# Altium schematic sheet SCH_1.SchDoc
size A3; DrawnBy: Prateek; Engineer: Prateek; SheetNumber: 1; SheetTotal: 1
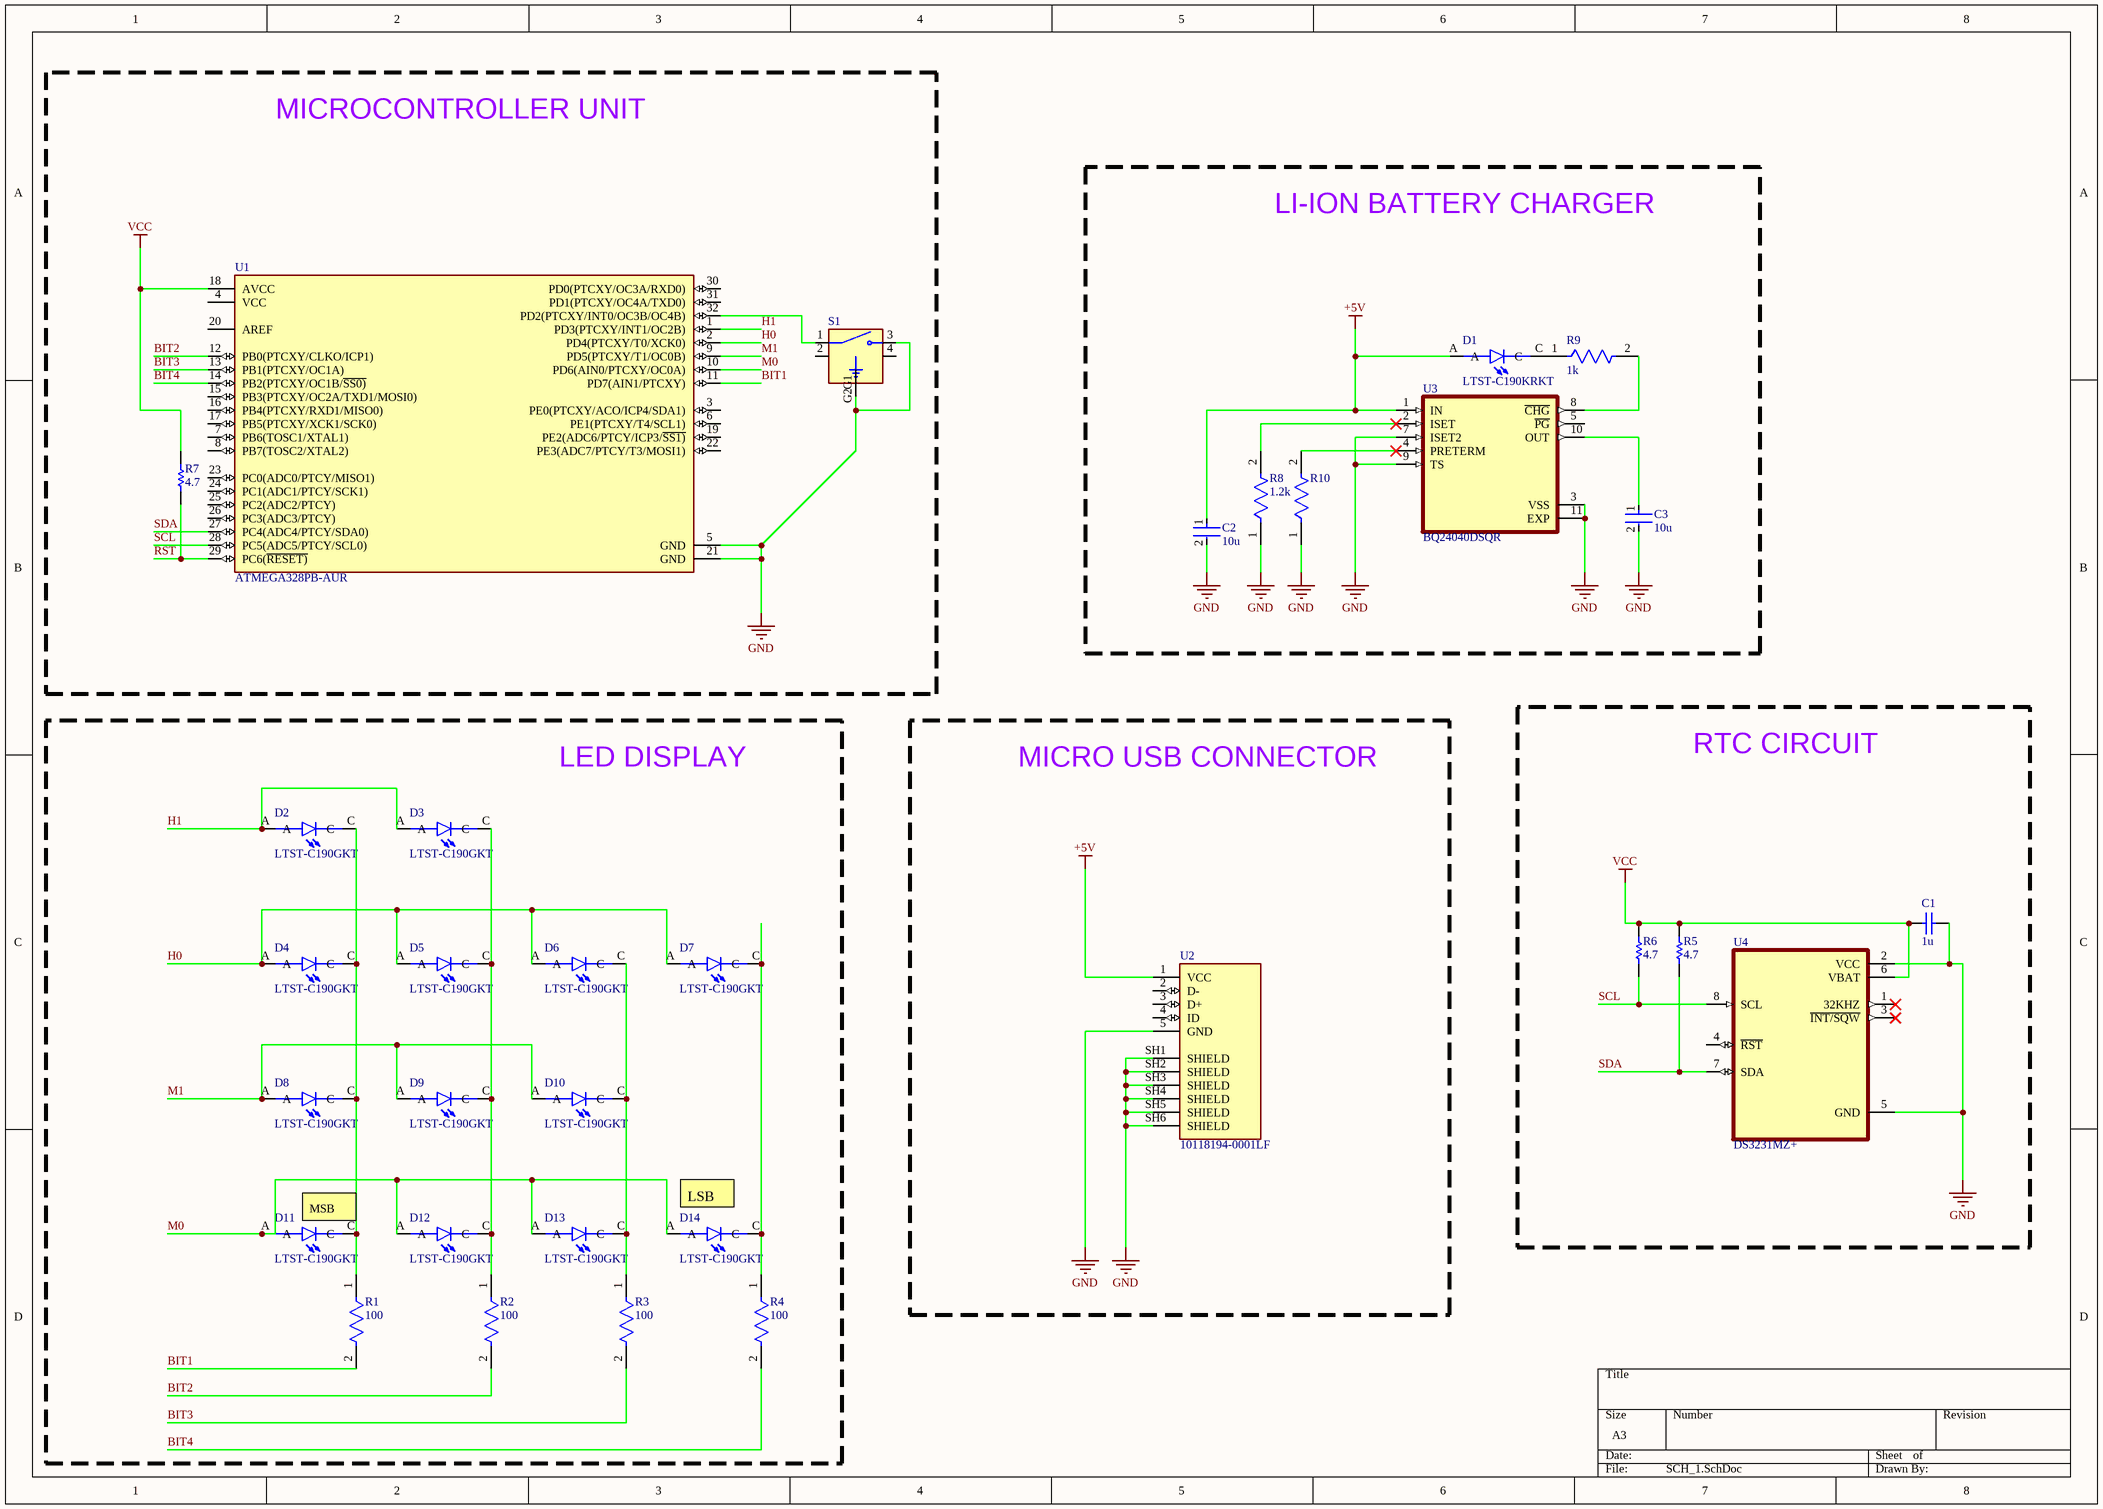
[diagram p0: SCH_1.SchDoc]

## Parts
C1  1u  [CAPC2013X135X45LL10T25]
C2  10u  [FP-GCM21B-0_15-IPC_C]
C3  10u  [FP-GCM21B-0_15-IPC_C]
D1  LTST-C190KRKT  [LEDC1608X35N]
D2  LTST-C190GKT  [LEDM1608X80]
D3  LTST-C190GKT  [LEDM1608X80]
D4  LTST-C190GKT  [LEDM1608X80]
D5  LTST-C190GKT  [LEDM1608X80]
D6  LTST-C190GKT  [LEDM1608X80]
D7  LTST-C190GKT  [LEDM1608X80]
D8  LTST-C190GKT  [LEDM1608X80]
D9  LTST-C190GKT  [LEDM1608X80]
D10  LTST-C190GKT  [LEDM1608X80]
D11  LTST-C190GKT  [LEDM1608X80]
D12  LTST-C190GKT  [LEDM1608X80]
D13  LTST-C190GKT  [LEDM1608X80]
D14  LTST-C190GKT  [LEDM1608X80]
R1  100  [FP-CRCW1206-e3-MFG]
R2  100  [FP-CRCW1206-e3-MFG]
R3  100  [FP-CRCW1206-e3-MFG]
R4  100  [FP-CRCW1206-e3-MFG]
R5  4.7  [RESC2013X70X40LL20T20]
R6  4.7  [RESC2013X70X40LL20T20]
R7  4.7  [RESC2013X70X40LL20T20]
R8  1.2k  [FP-CRCW1206-e3-MFG]
R9  1k  [FP-CRCW2512-e3-IPC_C]
R10  (no value)  [FP-CRCW0805-e3-IPC_C]
S1  (no value)  [SW_PTS526_SMG15_SMTR2_LFS]
U1  ATMEGA328PB-AUR  [FP-C04-074-MFG]
U2  10118194-0001LF  [AMPHENOL_10118194-0001LF]
U3  BQ24040DSQR  [SON40P200X200X80-11N]
U4  DS3231MZ+  [SOIC127P600X175-8N]

## Blocks framed on the sheet
MICROCONTROLLER UNIT: R7 S1 U1
LI-ION BATTERY CHARGER: C2 C3 D1 R8-R10 U3
RTC CIRCUIT: C1 R5 R6 U4
LED DISPLAY: D2-D14 R1-R4

## Nets
+5V: C2.1 D1.A U2.1(VCC) U3.1(IN)
GND: C1.2 C2.2 C3.2 R8.1 R10.1 S1.3(NO) S1.G2(GND) U1.5(GND) U1.21(GND) U2.5(GND) U2.SH1(SHIELD) U2.SH2(SHIELD) U2.SH3(SHIELD) U2.SH4(SHIELD) U2.SH5(SHIELD) U2.SH6(SHIELD) U3.3(VSS) U3.7(ISET2) U3.9(TS) U3.11(EXP) U4.2(VCC) U4.5(GND)
VCC: C1.1 R5.2 R6.2 R7.2 U1.18(AVCC) U4.6(VBAT)
BIT1: R1.2 U1.11(PD7(AIN1/PTCXY))
BIT2: R2.2 U1.12(PB0(PTCXY/CLKO/ICP1))
BIT3: R3.2 U1.13(PB1(PTCXY/OC1A))
BIT4: R4.2 U1.14(PB2(PTCXY/OC1B/~{SS0)})
H0: D4.A D5.A D6.A D7.A U1.2(PD4(PTCXY/T0/XCK0))
H1: D2.A D3.A U1.1(PD3(PTCXY/INT1/OC2B))
M0: D11.A D12.A D13.A D14.A U1.10(PD6(AIN0/PTCXY/OC0A))
M1: D8.A D9.A D10.A U1.9(PD5(PTCXY/T1/OC0B))
RST: R7.1 U1.29(PC6(~{RESET)})
SCL: R6.1 U1.28(PC5(ADC5/PTCY/SCL0)) U4.8(SCL)
SDA: R5.1 U1.27(PC4(ADC4/PTCY/SDA0)) U4.7(SDA)
NetC3_1: C3.1 U3.10(OUT)
NetD1_C: D1.C R9.1
NetD2_C: D2.C D4.C D8.C D11.C R1.1
NetD3_C: D3.C D5.C D9.C D12.C R2.1
NetD6_C: D6.C D10.C D13.C R3.1
NetD7_C: D7.C D14.C R4.1
NetR8_2: R8.2 U3.2(ISET)
NetR9_2: R9.2 U3.8(~{CHG})
NetR10_2: R10.2 U3.4(PRETERM)
NetS1_1: S1.1(COM) U1.32(PD2(PTCXY/INT0/OC3B/OC4B))

Not connected (* = marked no-connect by the designer): S1 2(COM) 4(NO) G1(GND); U1 3(PE0(PTCXY/ACO/ICP4/SDA1)) 4(VCC) 6(PE1(PTCXY/T4/SCL1)) 7(PB6(TOSC1/XTAL1)) 8(PB7(TOSC2/XTAL2)) 15(PB3(PTCXY/OC2A/TXD1/MOSI0)) 16(PB4(PTCXY/RXD1/MISO0)) 17(PB5(PTCXY/XCK1/SCK0)) 19(PE2(ADC6/PTCY/ICP3/~{SS1)}) 20(AREF) 22(PE3(ADC7/PTCY/T3/MOSI1)) 23(PC0(ADC0/PTCY/MISO1)) 24(PC1(ADC1/PTCY/SCK1)) 25(PC2(ADC2/PTCY)) 26(PC3(ADC3/PTCY)) 30(PD0(PTCXY/OC3A/RXD0)) 31(PD1(PTCXY/OC4A/TXD0)); U2 2(D-) 3(D+) 4(ID); U3 5(~{PG}); U4 1(32KHZ)* 3(~{INT/SQW})* 4(~{RST})

## Notes on the sheet
- MICRO USB CONNECTOR
- (near D11) MSB
- (near D14) LSB

## Library data of the parts
C1 = CMP-2007-03460-1: Manufacturer: Murata; Part Number: GRM21BR71C105KA01K
C2 C3 = CMP-2007-03335-2: Ceramic Capacitor for Automotive 10uF ±10% 6.3VDC X7R 0805 Embossed T/R; Voltage Rating: 6.3V; Voltage: 6.3V; Length: 2mm; Packaging: Tape and Reel; Radiation Hardening: No; Termination: SMD/SMT; Tolerance: 10%; Width: 0.049inch; Max Operating Temperature: 125°C; Mount: Surface Mount; Case/Package: 0805; Case Code (Imperial): 0805; Capacitance: 10uF; Ratings: AEC-Q200; Voltage Rating (DC): 6.3V; Height: 1.25mm; Dielectric: X7R; Case Code (Metric): 2012; Package Quantity: 1; Thickness: 0.055inch; Lead Free: Lead Free; Depth: 1.25mm; Min Operating Temperature: -55°C; REACH SVHC: No SVHC
D1 = LTST-C190KRKT: Red 631nm LED Indication - Discrete 2V 0603 (1608 Metric); MF: Lite-On Inc.; Check_prices: https://www.snapeda.com/parts/LTST-C190KRKT/Lite-On+Inc./view-part/?ref=eda; Value: *; Purchase-URL: https://pricing.snapeda.com/search/part/LTST-C190KRKT/?ref=eda; Price: None; MP: LTST-C190KRKT; SnapEDA_Link: https://www.snapeda.com/parts/LTST-C190KRKT/Lite-On+Inc./view-part/?ref=snap; Availability: In Stock; Package: 0603 Lite-On
D2-D14 = LTST-C190GKT: Green 1.6 x 0.8 x 0.8 mm 130Â° Water Clear 6 mcd 2.1 V SMT LED; Value: *; Price: None; Package: None; MP: LTST-C190GKT; Availability: Unavailable
R1-R4 = CMP-2003-04801-2: RES Thick Film, 100Ω, 1%, 0.25W, 100ppm/°C, 1206; Voltage Rating (DC): 200V; Resistance: 100R; Power Rating: 250mW; Case Code (Metric): 3216; Radiation Hardening: No; Height: 0.55mm; Packaging: Tape and Reel; Depth: 1.6mm; Weight: 0.000353oz; Termination: SMD/SMT; Lead Free: Lead Free; Min Operating Temperature: -55°C; Contact Plating: Tin; Max Operating Temperature: 155°C; Case Code (Imperial): 1206; Military Standard: Not; Width: 1.6mm; Number of Pins: 2; Voltage Rating: 200V; Composition: Thick Film; Package Quantity: 5000; Tolerance: 1%; Case/Package: 1206; Mount: Surface Mount; Length: 3.2mm; Temperature Coefficient: 100ppm/°C
R5-R7 = CMP-1665-00033-1: Chip Resistor, 4.7 Ohm, +/- 1%, 125 mW, -55 to 125 degC, 0805 (2012 Metric), RoHS, Tape and Reel; PartNumber: ERJ-6RQF4R7V; Power Rating: 125 mW; Case\/Package: 0805; Resistance: 4.7 Ohm; Mount: Surface Mount; Length: 0.079 inch; Tolerance: 1%; REACH SVHC: No SVHC; PackageDescription: 2-Pin Surface Mount Device, Body 2 x 1.5 mm; ComponentLink1URL: http://www.panasonic.com/; Width: 0.049 inch; Min Operating Temperature: -55 degC; Height: 0.028 inch; Case Code (Metric): 2012; Mounting Technology: Surface Mount; Pins: 2; Max Operating Temperature: 125 degC; Packaging: Tape and Reel; ComponentLink2URL: http://industrial.panasonic.com/cdbs/www-data/pdf/RDA0000/AOA0000C86.pdf; RoHSCompliant: true; ComponentLink2Description: Datasheet; PackageReference: 0805; Package Quantity: 5000; ComponentLink1Description: Manufacturer URL; Radiation Hardening: No; Case Code (Imperial): 0805; DatasheetVersion: 04/2015
R8 = CMP-2003-01876-2: RES Thick Film, 1.2kΩ, 1%, 0.25W, 100ppm/°C, 1206; Voltage Rating (DC): 200V; Power Rating: 250mW; Resistance: 1.2kR; Temperature Coefficient: 100ppm/°C; Features: Automotive AEC-Q200; Lead Free: Lead Free; Termination: SMD/SMT; Composition: Thick Film; Length: 3.2mm; Width: 0.063inch; Case Code (Imperial): 1206; Contact Plating: Tin; Number of Terminations: 2; Height: 0.55mm; Depth: 1.6mm; Max Operating Temperature: 155°C; Tolerance: 1%; Case/Package: 1206; Voltage Rating: 200V; Case Code (Metric): 3216; Packaging: Tape and Reel; Weight: 0.000353oz; Package Quantity: 10; Max Power Dissipation: 250mW; Min Operating Temperature: -55°C; Working Voltage: 200V; Radiation Hardening: No; Military Standard: Not
R9 = CMP-02407-005880-1: RES Thick Film, 1kΩ, 1%, 1W, 100ppm/°C, 2512; Resistance: 1kR; Voltage Rating (DC): 500V; Case Code (Metric): 6432; Height: 0.6mm; Termination: SMD/SMT; Weight: 0.001429oz; Packaging: Tape and Reel; Composition: Thick Film; Number of Terminations: 2; Mount: Surface Mount; Max Operating Temperature: 155°C; Tolerance: 1%; Width: 3.15mm; Features: Automotive AEC-Q200; Contact Plating: Tin; Package Quantity: 10; Temperature Coefficient: 100ppm/°C; Lead Free: Lead Free; Power Rating: 1W; Min Operating Temperature: -55°C; Number of Pins: 2; Case/Package: 2512; Military Standard: Not; Max Power Dissipation: 1W; Length: 6.3mm; Depth: 3.15mm; Radiation Hardening: No; Case Code (Imperial): 2512; Voltage Rating: 500V
R10 = CMP-2001-04910-2: RES Thick Film, 10kΩ, 5%, 0.125W, 200ppm/°C, 0805; Voltage Rating: 150V; Resistance: 10kR; Power Rating: 125mW; Composition: Thick Film; Termination: SMD/SMT; Case Code (Imperial): 0805; Temperature Coefficient: 200ppm/°C; Contact Plating: Tin; Tolerance: 5%; Military Standard: Not; Height: 0.45mm; Weight: 0.000194oz; Length: 2mm; Packaging: Tape and Reel; Mount: Surface Mount; Width: 1.25mm; Depth: 1.25mm; Voltage Rating (DC): 150V; Lead Free: Lead Free; Case/Package: 0805; Radiation Hardening: No; Max Operating Temperature: 155°C; Min Operating Temperature: -55°C; Case Code (Metric): 2012; Package Quantity: 5000
S1 = PTS526_SMG15_SMTR2_LFS: Tactile Switch SPST-NO Top Actuated Surface Mount; MP: PTS526 SMG15 SMTR2 LFS; MF: C&K; Availability: In Stock; SnapEDA_Link: https://www.snapeda.com/parts/PTS526%20SMG15%20SMTR2%20LFS/C%2526K/view-part/?ref=snap; Value: *; Package: None; Price: None; Purchase-URL: https://pricing.snapeda.com/search/part/PTS526 SMG15 SMTR2 LFS/?ref=eda; Check_prices: https://www.snapeda.com/parts/PTS526%20SMG15%20SMTR2%20LFS/C%2526K/view-part/?ref=eda
U1 = CMP-06276-000006-1: IC MCU 8BIT 32KB FLASH 32TQFP; Manufacturer: Microchip; Ram Size: 2KBytes; Number Of Spi Channels: 2; Interface: I2C,SPI,UART,USART,2-Wire; Number Of Pwm Channels: 10; Nominal Supply Current: 0.06-5.2mA; Number Of Timers/Counters: 5; Number Of Cores: 1; Memory Size: 32KBytes; Frequency: 20MHz; Min Supply Voltage: 1.8V; Core Architecture: AVR; Data Bus Width: 8bits; Max Supply Voltage: 5.5V; Standoff Height: 0.05mm; Number Of Adc Channels: 8; Number Of I/Os: 27; RoHS: TRUE; Automotive: No; Temperature Range Low: -40°C; Category: IC; Octopart: https://octopart.com/atmega328pb-aur-microchip-77760229; Height: 1.2mm; Number Of I2C Channels: 2; Digikey Description: IC MCU 8BIT 32KB FLASH 32TQFP; Number Of Uart Channels: 2; Manufacturer Part Number: ATMEGA328PB-AUR; ComponentLink2Description: Datasheet; Device Class L1: Integrated Circuits (ICs); Package: C04-074; Lead Free: Yes; Temperature Range High: +85°C; Temperature: -40°C to +85°C; Memory Type: FLASH; Number Of A/D Converters: 1; Device Class L2: Embedded Processors and Controllers; ComponentLink2URL: http://ww1.microchip.com/downloads/en/DeviceDoc/40001906C.pdf; Device Class L3: Microcontrollers; Ipc Land Pattern Name: QFP80P900X900X120-32; Footprint Url: https://ww1.microchip.com/downloads/en/DeviceDoc/32L_TQFP_7x7x1_0mm_PT_C04-00074c.pdf
U2 = 10118194-0001LF: Micro USB, Input Output Connectors, B TYPE RECEPTACLE with flange; MF: Amphenol ICC; SnapEDA_Link: https://www.snapeda.com/parts/10118194-0001LF/Amphenol+FCI/view-part/?ref=snap; Package: None; Value: *; MP: 10118194-0001LF; Check_prices: https://www.snapeda.com/parts/10118194-0001LF/Amphenol+FCI/view-part/?ref=eda
U3 = BQ24040DSQR: Standalone 1-cell 1-A linear battery charger with 4.2-V VBAT and Temperature Sensing 10-WSON 0 to 125; MF: Texas Instruments; SnapEDA_Link: https://www.snapeda.com/parts/BQ24040DSQR/Texas%20Instruments/view-part/229310/?ref=snap; Mouser-Purchase-URL: https://snapeda.com/shop?store=Mouser&id=229310; Digi-Key_Part_Number: 296-37142-1-ND; DigiKey-Purchase-URL: https://snapeda.com/shop?store=DigiKey&id=229310; Value: *; Texas_Instruments-Purchase-URL: https://snapeda.com/shop?store=Texas+Instruments&id=229310; MP: BQ24040DSQR; Package: WSON-10 Texas Instruments
U4 = DS3231MZ+: Real Time Clock _RTC_ IC Clock/Calendar IÂ²C, 2-Wire Serial 8-SOIC _0.154, 3.90mm Width_; MF: Maxim Integrated; MP: DS3231MZ; Price: None; Availability: Unavailable; Package: SOIC-8 Maxim Integrated; SnapEDA_Link: https://www.snapeda.com/parts/DS3231MZ/Maxim%20Integrated/view-part/2834343/?ref=snap; Value: *